# EAGLE design Wireless Weather Station (EAGLE 6.4)
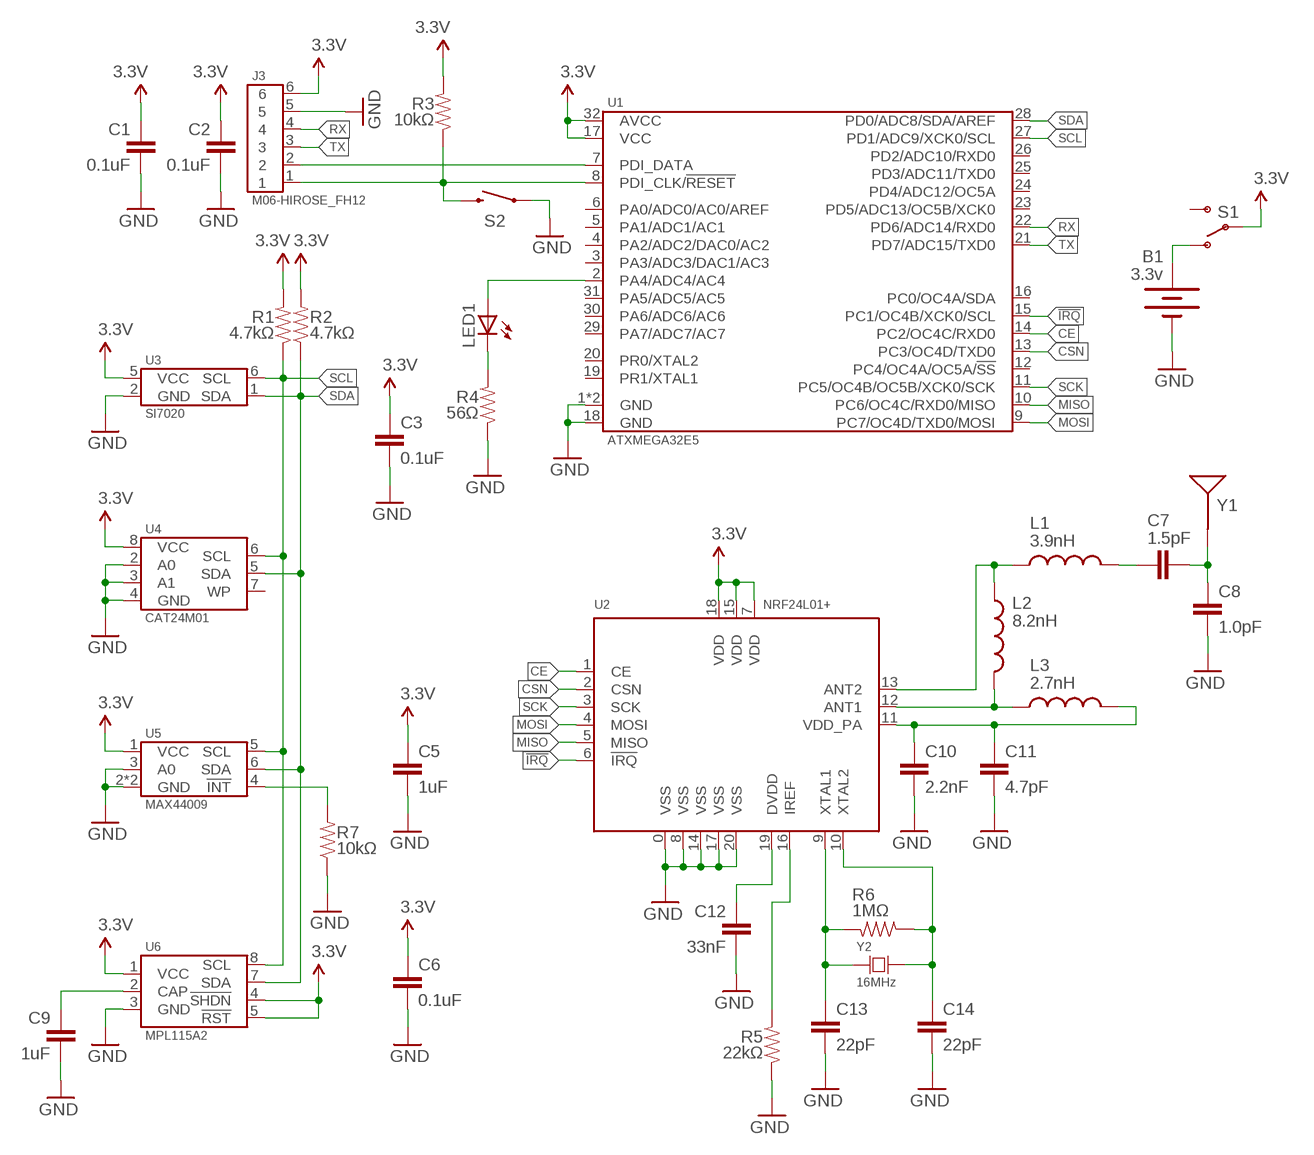
[diagram p0: schematic, sheet 1]

## Parts
B1  3.3v  BATTERY20MM-SEWABLE  [BATTCON_20MM_SEWABLE]
C1  0.1uF  CAP0402-CAP  [0402-CAP]
C2  0.1uF  CAP0402-CAP  [0402-CAP]
C3  0.1uF  CAP0402-CAP  [0402-CAP]
C5  1uF  CAP0402-CAP  [0402-CAP]
C6  0.1uF  CAP0402-CAP  [0402-CAP]
C7  1.5pF  CAP0402-CAP  [0402-CAP]
C8  1.0pF  CAP0402-CAP  [0402-CAP]
C9  1uF  CAP0402-CAP  [0402-CAP]
C10  2.2nF  CAP0402-CAP  [0402-CAP]
C11  4.7pF  CAP0402-CAP  [0402-CAP]
C12  33nF  CAP0402-CAP  [0402-CAP]
C13  22pF  CAP0402-CAP  [0402-CAP]
C14  22pF  CAP0402-CAP  [0402-CAP]
J3  M06-HIROSE_FH12  [FH12-6S-1SH(55)]
L1  3.9nH  INDUCTOR0402  [C0402]
L2  8.2nH  INDUCTOR0402  [C0402]
L3  2.7nH  INDUCTOR0402  [C0402]
LED1  LED0603  [LED-0603]
R1  4.7kΩ  RESISTOR0402-RES  [0402-RES]
R2  4.7kΩ  RESISTOR0402-RES  [0402-RES]
R3  10kΩ  RESISTOR0402-RES  [0402-RES]
R4  56Ω  RESISTOR0402-RES  [0402-RES]
R5  22kΩ  RESISTOR0402-RES  [0402-RES]
R6  1MΩ  RESISTOR0402-RES  [0402-RES]
R7  10kΩ  RESISTOR0402-RES  [0402-RES]
S1  SWITCH-SPDT-SMD-A  [SWITCH-SPST-SMD-A]
S2  SWITCH-MOMENTARY-2-SMD-1101NE  [TACTILE-SWITCH-1101NE]
U1  ATXMEGA32E5  [QFN-32]
U2  NRF24L01+  [QFN-20]
U3  SI7020  [SI7020]
U4  CAT24M01  [SO-8]
U5  MAX44009  [MAX44009]
U6  MPL115A2  [MPL115A1]
Y1  ANTENNA2SMD5  [ANTENNA-CHIP5]
Y2  16MHz  CRYSTAL-3.2X2.5  [FA-238]

## Nets
3.3V: C1.1 C2.1 C3.1 C5.1 C6.1 J3.6 R1.2 R2.2 R3.2 S1.2(P) U1.17(VCC) U1.32(AVCC) U2.7(VDD) U2.15(VDD) U2.18(VDD) U3.5(VCC) U4.8(VCC) U5.1(VCC) U6.1(VCC) U6.4(!SHDN) U6.5(!RST)
!IRQ: U1.15(PC1/OC4B/XCK0/SCL) U2.6(!IRQ)
CE: U1.14(PC2/OC4C/RXD0) U2.1(CE)
CSN: U1.13(PC3/OC4D/TXD0) U2.2(CSN)
GND: B1.2(-) C1.2 C2.2 C3.2 C5.2 C6.2 C8.2 C9.2 C10.2 C11.2 C12.2 C13.2 C14.2 J3.5 R4.1 R5.1 R7.1 S2.P$1 U1.1(GND) U1.18(GND) U1.EP(GND) U2.0(VSS) U2.8(VSS) U2.14(VSS) U2.17(VSS) U2.20(VSS) U3.2(GND) U4.2(A0) U4.3(A1) U4.4(GND) U5.2(GND) U5.3(A0) U5.PAD(GND) U6.3(GND)
MISO: U1.10(PC6/OC4C/RXD0/MISO) U2.5(MISO)
MOSI: U1.9(PC7/OC4D/TXD0/MOSI) U2.4(MOSI)
N$1: C7.1 L1.2
N$2: C9.1 U6.2(CAP)
N$3: B1.1(+) S1.1(O)
N$4: J3.1 R3.1 S2.P$2 U1.8(PDI_CLK/!RESET)
N$5: LED1.C R4.2
N$6: J3.2 U1.7(PDI_DATA)
N$7: LED1.A U1.2(PA4/ADC4/AC4)
N$8: C7.2 C8.1 Y1.FEED(SIGNAL)
N$9: R5.2 U2.16(IREF)
N$10: L1.1 L2.1 U2.13(ANT2)
N$11: C10.1 C11.1 L3.2 U2.11(VDD_PA)
N$12: L2.2 L3.1 U2.12(ANT1)
N$13: C12.1 U2.19(DVDD)
N$14: C13.1 R6.2 U2.9(XTAL1) Y2.1
N$15: C14.1 R6.1 U2.10(XTAL2) Y2.3
N$16: R7.2 U5.4(!INT)
RX: J3.4 U1.22(PD6/ADC14/RXD0)
SCK: U1.11(PC5/OC4B/OC5B/XCK0/SCK) U2.3(SCK)
SCL: R1.1 U1.27(PD1/ADC9/XCK0/SCL) U3.6(SCL) U4.6(SCL) U5.5(SCL) U6.8(SCL)
SDA: R2.1 U1.28(PD0/ADC8/SDA/AREF) U3.1(SDA) U4.5(SDA) U5.6(SDA) U6.7(SDA)
TX: J3.3 U1.21(PD7/ADC15/TXD0)
Unconnected: S1.3(S) U1.3(PA3/ADC3/DAC1/AC3) U1.4(PA2/ADC2/DAC0/AC2) U1.5(PA1/ADC1/AC1) U1.6(PA0/ADC0/AC0/AREF) U1.12(PC4/OC4A/OC5A/!SS!) U1.16(PC0/OC4A/SDA) U1.19(PR1/XTAL1) U1.20(PR0/XTAL2) U1.23(PD5/ADC13/OC5B/XCK0) U1.24(PD4/ADC12/OC5A) U1.25(PD3/ADC11/TXD0) U1.26(PD2/ADC10/RXD0) U1.29(PA7/ADC7/AC7) U1.30(PA6/ADC6/AC6) U1.31(PA5/ADC5/AC5) U4.7(WP)

## Library data of the parts
B1 = SparkFun-Electromechanical:BATTERY: Battery Holders Various common sizes : AA, AAA, 20mm coin cell and 12mm coin cell. 20MM_4LEGS, BATT-10373; PROD_ID: DEV-08822
C1-C3 C5-C14 = SparkFun-Passives:CAP: Capacitor Standard 0603 ceramic capacitor, and 0.1" leaded capacitor.
J3 = Hirose:M06
L1-L3 = SparkFun-Passives:INDUCTOR: Inductors Basic Inductor/Choke - 0603 and 1206. Footprints are not proven and vary greatly between part numbers. SRN6045- 33uH, 20% 1.4A SDR0403-560KL - 56uH, 10%, 500mA RMS/740mA peak
LED1 = SparkFun-LED:LED: LEDs Standard schematic elements and footprints for 5mm, 3mm, 1206, and 0603 sized LEDs. 5mm - Spark Fun Electronics SKU : COM-00529 (and others)
R1-R7 = SparkFun-Passives:RESISTOR: Resistor Basic schematic elements and footprints for 0603, 1206, and PTH resistors.
S1 = SparkFun-Electromechanical:SWITCH-SPDT: SPDT Switch Simple slide switch, Spark Fun Electronics SKU : COM-00102 DPDT SMT slide switch, AYZ0202, SWCH-08179
S2 = SparkFun-Electromechanical:SWITCH-MOMENTARY-2: Various NO switches- pushbuttons, reed, etc
U1 = Atmel:ATXMEGA32E5
U2 = Nordic:NRF24L01+
U3 = Silicon Labs:SI7020: Silicon Labs Humidity/Temperature Sensor
U4 = ON Semiconductor:CAT24M01: 1Mb I2C CMOS EEPROM
U5 = Maxim:MAX44009: Ambient Light Sensor
U6 = Freescale:MPL115A2: Barometric Pressure Sensor
Y1 = SparkFun-RF:ANTENNA2: Chip antenna Single endded antenna. Common with smaller chip antennas. CHIP4 package is the GPS Chip Antenna SKU: GPS-08418. CHIP5 package is 2.4GHz chip antenna SKU: WRL-00144.
Y2 = Passives:CRYSTAL

## Board
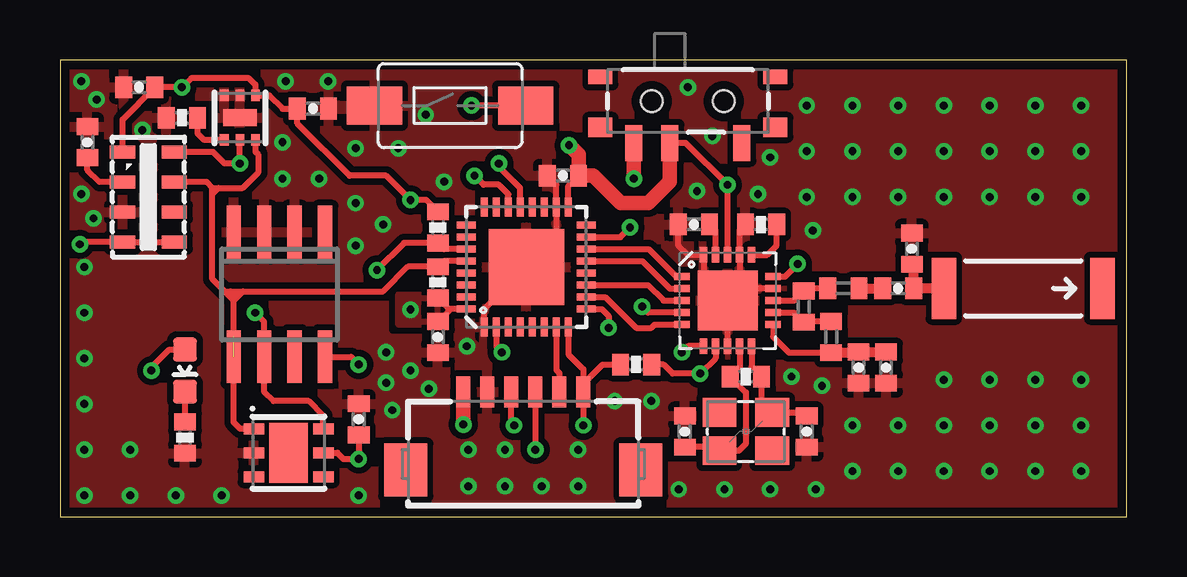
[diagram p1: board, top side]
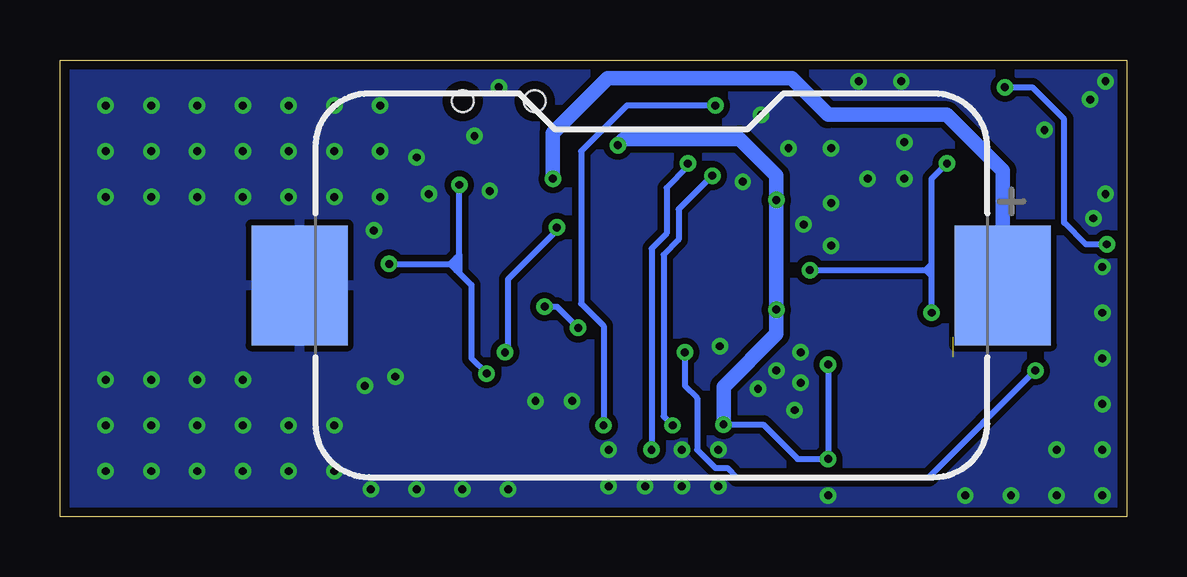
[diagram p2: board, bottom side, seen from below]

Size 44.45 x 19.05 mm. Coordinates in mm from the lower left corner, seen from the top.
Outline: 0,0 44.45,0 44.45,19.05 0,19.05 0,0
Copper layers (1*16): Top 0.0356mm / dielectric 1.5011mm / Bottom 0.0356mm
Design rules "oshpark-2layer": minimum track width 6mil, minimum drill 13mil, track to track 6mil, track to pad 6mil, pad to pad 6mil, via to via 6mil, smd to smd 6mil, copper to edge 15mil, drill to drill 6mil, minimum pad ring 7mil, minimum via ring 7mil, stop-mask expansion 4mil, vias tented up to drill 0mil, thermal gap 10mil

### Footprints (pad centres in the part's own frame; a part is rotated, then mirrored left to right if it is on the bottom)
BATTCON_20MM_SEWABLE = smd 4 x 5: 1 14.65,0; 2 -14.65,0
0402-CAP = smd 0.7 x 0.9: 1 -0.65,0; 2 0.65,0
FH12-6S-1SH(55) = smd 0.6 x 1.3: 1 -2.5,0; 2 -1.5,0; 3 -0.5,0; 4 0.5,0; 5 1.5,0; 6 2.5,0 | smd 1.8 x 2.2: P$7 -4.9,3.25; P$8 4.9,3.25
C0402 = smd 0.7 x 0.9: 1 -0.65,0; 2 0.65,0
LED-0603 = smd 1 x 1: A 0,-0.877; C 0,0.877
0402-RES = smd 0.7 x 0.9: 1 -0.65,0; 2 0.65,0
SWITCH-SPST-SMD-A = smd 0.7 x 1.5: 1 -2.25,-1.75; 2 -0.75,-1.75; 3 2.25,-1.75 | smd 1 x 0.6: GND1 -3.65,1; GND3 3.65,1 | smd 1 x 0.8: GND2 -3.65,-1.1; GND4 3.65,-1.1 | hole 0.9: -1.5,0; 1.5,0
TACTILE-SWITCH-1101NE = smd 2.3 x 1.6: P$1 -3.15,0; P$2 3.15,0
QFN-32 = smd 0.285 x 0.8: 1 -1.75,-2.5; 2 -1.25,-2.5; 3 -0.75,-2.5; 4 -0.25,-2.5; 5 0.25,-2.5; 6 0.75,-2.5; 7 1.25,-2.5; 8 1.75,-2.5; 17 1.75,2.5; 18 1.25,2.5; 19 0.75,2.5; 20 0.25,2.5; 21 -0.25,2.5; 22 -0.75,2.5; 23 -1.25,2.5; 24 -1.75,2.5 | smd 0.8 x 0.285: 9 2.5,-1.75; 10 2.5,-1.25; 11 2.5,-0.75; 12 2.5,-0.25; 13 2.5,0.25; 14 2.5,0.75; 15 2.5,1.25; 16 2.5,1.75; 25 -2.5,1.75; 26 -2.5,1.25; 27 -2.5,0.75; 28 -2.5,0.25; 29 -2.5,-0.25; 30 -2.5,-0.75; 31 -2.5,-1.25; 32 -2.5,-1.75 | smd 3.15 x 3.15: EP 0,0
QFN-20 = smd 2.5 x 2.5: 0 0,0 | smd 0.65 x 0.3: 1 -1.9,1; 2 -1.9,0.5; 3 -1.9,0; 4 -1.9,-0.5; 5 -1.9,-1; 11 1.9,-1; 12 1.9,-0.5; 13 1.9,0; 14 1.9,0.5; 15 1.9,1 | smd 0.3 x 0.65: 6 -1,-1.9; 7 -0.5,-1.9; 8 0,-1.9; 9 0.5,-1.9; 10 1,-1.9; 16 1,1.9; 17 0.5,1.9; 18 0,1.9; 19 -0.5,1.9; 20 -1,1.9
SI7020 = smd 0.85 x 0.45: 1 -1.45,1; 2 -1.45,0; 3 -1.45,-1; 4 1.45,-1; 5 1.45,0; 6 1.45,1 | smd 1.6 x 2.5: PAD 0,0
SO-8 = smd 2.2 x 0.6: 1 -2.6,1.905; 2 -2.6,0.635; 3 -2.6,-0.635; 4 -2.6,-1.905; 5 2.6,-1.905; 6 2.6,-0.635; 7 2.6,0.635; 8 2.6,1.905
MAX44009 = smd 0.48 x 0.36: 1 -0.925,0.65; 2 -0.925,0; 3 -0.925,-0.65; 4 0.925,-0.65; 5 0.925,0; 6 0.925,0.65 | smd 0.71 x 1.4: PAD 0,0
MPL115A1 = smd 1.05 x 0.55: 1 -1.075,1.875; 2 -1.075,0.625; 3 -1.075,-0.625; 4 -1.075,-1.875; 5 1.075,-1.875; 6 1.075,-0.625; 7 1.075,0.625; 8 1.075,1.875
ANTENNA-CHIP5 = smd 1.016 x 2.54: FEED -3.302,0; NC 3.302,0
FA-238 = smd 1.4 x 1.2: 1 -1.1,-0.8; 2 1.1,-0.8; 3 1.1,0.8; 4 -1.1,0.8

### Placement (x,y rotation side)
B1  19.81,9.65 0 bottom
C1  20.95,14.22 180 top
C2  15.75,7.49 270 top
C3  12.45,4.06 90 top
C5  10.54,17.02 0 top
C6  3.3,17.91 180 top
C7  34.92,9.53 0 top
C8  35.5,11.18 90 top
C9  1.14,15.62 90 top
C10  33.27,6.22 270 top
C11  34.42,6.22 270 top
C12  26.42,12.19 180 top
C13  26.04,3.56 90 top
C14  31.11,3.56 270 top
J3  19.3,5.21 180 top
L1  32.64,9.53 0 top
L2  30.99,8.76 270 top
L3  32.13,7.49 270 top
LED1  5.21,6.1 180 top
R1  15.75,12.06 90 top
R2  15.75,9.78 270 top
R3  24,6.35 0 top
R4  5.21,3.3 90 top
R5  29.21,12.19 0 top
R6  28.57,5.84 180 top
R7  5.08,16.64 0 top
S1  26.16,17.34 0 top
S2  16.26,17.14 0 top
U1  19.43,10.41 0 top
U2  27.81,9.02 0 top
U3  9.53,2.67 0 top
U4  9.14,9.27 270 top
U5  7.49,16.64 270 top
U6  3.68,13.34 0 top
Y1  40.13,9.53 0 top
Y2  28.57,3.56 0 top

### Tracks (layer width: path | path; a pad name or v marks a point on that pad's centre or on a via)
3.3V  (via drill 0.33)
  Top 0.254: U1.17 21.18,13.8 C1.1 | U1.32 16.21,8.66 | 16.21,8.66 R2.2 | 16.21,8.66 16.21,8.61 C2.1 | U2.18 v27.81,13.84 26.07,15.59 S1.2 | U2.7 27.31,6.61 v26.67,5.97 25.53,5.97 25.15,6.35 R3.2 | U2.15 30.21,10.02 v30.73,10.54 | C3.1 v12.45,2.41 11.81,2.41 11.56,2.67 U3.5 | U4.8 12.12,6.67 v12.45,6.35 | R1.2 15.26,13.21 v14.61,13.21 13.59,14.22 12.06,14.22 9.89,16.4 C5.1 9.27,17.02 8.73,17.56 U5.1 8.14,18.02 7.87,18.29 5.46,18.29 v5.08,17.91 C6.1 | U6.5 U6.4 0.93,11.46 v0.83,11.36 | C6.1 | U6.1 2.61,16.56 C6.1
  Top 0.61: S1.2 25.41,13.98 24.51,13.08 23.37,13.08 22.23,14.22 C1.1 21.61,15.1 v21.21,15.49 | J3.6 v16.8,3.85
  Bottom 0.254: v30.73,10.54 28.19,10.54 | 28.19,10.54 27.93,10.79 | U2.18 v27.81,13.84 | 28.19,10.54 27.31,9.66 27.31,6.61 v26.67,5.97 | U2.18 27.81,10.16 | 27.94,10.29 27.94,10.79 27.93,10.79 | 27.93,10.79 U2.18 | v16.8,3.85 15.15,3.85 13.72,2.41 v12.45,2.41 v12.45,6.35 | v5.08,17.91 3.94,17.91 2.61,16.58 2.61,12.26 1.71,11.36 v0.83,11.36
  Bottom 0.61: v16.8,3.85 16.8,5.42 14.61,7.62 v14.61,8.64 v14.61,13.21 14.61,14.22 16.13,15.75 20.95,15.75 v21.21,15.49
  pour Top: 16,9.27 16,8 14.1,8 14.1,9.27
!IRQ  (via drill 0.33)
  Top 0.254: U2.6 26.17,7.12 v25.91,6.86 | U1.15 23.35,11.66 v23.75,12.06
  Bottom 0.254: v25.91,6.86 25.78,6.99 25.78,9.91 23.75,11.94 v23.75,12.06
CE
  Top 0.254: U1.14 24.52,11.16 25.67,10.02 U2.1
CSN
  Top 0.254: U1.13 24.26,10.66 25.41,9.52 U2.2
GND  (via drill 0.33)
  Top 0.254: R5.1 28.31,11.95 U2.17 28.31,9.9 28.07,9.65 28.07,9.27 U2.0 | C12.2 25.77,11.32 26.17,10.92 U2.20 26.81,10.02 U2.0 | U2.8 U2.0 | C1.2 20.68,13.85 U1.18 20.68,11.79 20.32,11.43 20.32,11.3 U1.EP 17.68,8.66 U1.1 | U2.14 28.31,9.52 U2.0
  other vias: 42.55,17.14 42.55,15.24 42.55,13.34 40.64,13.34 40.64,15.24 40.64,17.14 38.73,17.14 38.73,15.24 38.73,13.34 36.83,13.34 36.83,15.24 36.83,17.14 34.92,17.14 34.92,13.34 34.92,15.24 31.37,11.94 33.02,13.34 31.11,13.34 31.11,15.24 31.11,17.14 33.02,17.14 33.02,15.24 42.55,5.71 42.55,3.81 42.55,1.91 40.64,1.91 40.64,3.81 40.64,5.71 38.73,5.71 38.73,3.81 38.73,1.91 36.83,5.71 36.83,3.81 34.92,3.81 33.02,3.81 33.02,1.91 34.92,1.91 36.83,1.91 29.08,13.46 26.54,13.59 24.64,4.83 31.5,1.14 29.59,1.14 27.69,1.14 25.78,1.14 23.11,4.83 21.59,2.79 21.59,1.27 20.07,1.27 18.54,1.27 18.54,2.79 15.37,5.33 17.02,1.27 17.02,2.79 16.95,7.11 13.59,5.59 13.84,4.45 14.1,15.37 26.16,17.91 27.18,15.88 9.27,15.62 10.79,14.1 9.27,14.1 12.32,13.08 12.32,15.37 12.45,0.89 0.89,18.16 1.52,17.4 3.43,16.13 0.89,13.46 11.18,18.16 1.4,12.45 13.46,12.19 12.32,11.3 29.59,14.99 16,13.97 15.24,16.76 9.4,18.16 13.59,6.86 14.61,6.1 31.75,5.46 30.48,5.84 6.73,0.89 4.83,0.89 2.92,0.89 1.02,0.89 1.02,2.79 1.02,4.7 1.02,6.6 1.02,8.51 1.02,10.41 2.92,2.79
  pour Bottom (isolate 0.254, rank 2): -2.54,21.59 46.99,21.59 46.99,-2.54 -2.54,-2.54
  pour Top (isolate 0.254, rank 2): -1.27,20.32 45.72,20.32 45.72,-1.27 -1.27,-1.27
MISO
  Top 0.254: U1.10 22.71,9.16 24,7.87 24.64,7.87 24.78,8.02 U2.5
MOSI  (via drill 0.33)
  Top 0.254: U2.4 24.5,8.52 v24.26,8.76 | U1.9 22.58,8.66 22.86,8.38 v22.86,7.87
  Bottom 0.254: v24.26,8.76 23.75,8.76 v22.86,7.87
N$1
  Top 0.254: 33.4,9.53 L1.2 | 34.16,9.53 C7.1
  Top 0.406: 33.4,9.53 34.16,9.53
N$2
  Top 0.254: U6.2 1.65,13.96 1.14,14.46 C9.1
N$3  (via drill 0.33)
  Top 0.61: v23.91,14.1 S1.1
  Bottom 0.61: v23.91,14.1 23.91,16 21.63,18.29 13.97,18.29 12.45,16.76 7.49,16.76 5.16,14.43 B1.1
N$4  (via drill 0.33)
  Top 0.254: J3.1 21.8,6.15 21.18,6.77 U1.8 | J3.1 21.97,5.71 22.61,6.35 R3.1 | S2.P$2 v17.14,17.14 | J3.1 v21.8,3.81
  Bottom 0.254: v17.14,17.14 20.83,17.14 22.73,15.24 22.73,8.89 21.8,7.96 v21.8,3.81
N$5
  Top 0.254: LED1.C R4.2
N$6
  Top 0.254: U1.7 20.68,6.12 20.8,5.99 J3.2
N$7  (via drill 0.33)
  Top 0.254: U1.2 18.18,7.09 v18.41,6.86 | v3.81,6.1 3.81,6.22 4.56,6.97 LED1.A
  Bottom 0.254: v18.41,6.86 18.41,5.46 17.91,4.95 17.91,2.79 17.14,2.03 16.64,2.03 16.26,1.65 8.26,1.65 v3.81,6.1
N$8
  Top 0.254: C7.2 35.69,9.53
  Top 0.406: Y1.FEED 35.69,9.53 | C7.2 35.58,10.45
  Top 0.686: 35.58,10.45 C8.1
N$9
  Top 0.254: U2.16 29.46,10.92 29.86,11.32 R5.2
N$10
  Top 0.254: L1.1 31.1,9.53 L2.1 30.59,9.02 U2.13
N$11
  Top 0.254: U2.11 29.71,7.5 30.37,6.84 L3.2
  Top 0.406: L3.2 33.24,6.84 C10.1 C11.1
N$12
  Top 0.254: L3.1 31.02,8.14 L2.2 30.58,8.52 U2.12
N$13
  Top 0.254: U2.19 27.31,11.95 C12.1
N$14
  Top 0.254: U2.9 28.31,6.23 R6.2 28.57,5.19 28.57,3.05 28.28,2.76 Y2.1 27.32,2.91 C13.1
N$15
  Top 0.254: U2.10 28.81,6.25 R6.1 29.23,4.81 Y2.3 30.96,4.36 C14.1
N$16
  Top 0.254: U5.4 6,15.71 5.73,15.99 R7.2
RX  (via drill 0.33)
  Top 0.254: U1.22 18.68,13.45 18.29,13.84 17.65,13.84 v17.27,14.22 | v18.92,3.81 18.8,3.94 J3.4
  Bottom 0.254: v17.27,14.22 18.67,12.83 18.67,11.56 19.3,10.92 19.3,4.19 v18.92,3.81
SCK
  Top 0.254: U1.11 24.5,9.66 25.15,9.02 U2.3
SCL  (via drill 0.33)
  Top 0.254: U1.27 16,11.16 R1.1 14.34,11.41 v13.21,10.29 | U3.6 10.97,4.21 10.36,4.83 8.9,4.83 8.51,5.22 U4.6 8.51,8.13 v8.13,8.51 | U5.5 v7.49,14.73 6.86,14.73 6.38,15.21 U6.8
  Bottom 0.254: v13.21,10.29 8.38,10.29 | 8.38,10.29 8.13,10.29 | v7.49,14.73 8.13,14.1 8.13,10.54 | v8.13,8.51 8.13,10.03 | 8.13,10.03 8.13,10.29 | 8.13,10.29 8.13,10.54 | 8.13,10.54 8.38,10.29 | 8.38,10.29 8.13,10.03
SDA  (1 unrouted)
  Top 0.254: U1.28 15.98,10.66 R2.1 14.49,10.43 13.46,9.4 7.62,9.4 | U3.1 7.51,3.67 7.24,3.94 U4.5 | 6.86,9.4 6.35,9.91 6.35,13.46 | 6.35,13.46 6.35,13.72 | 6.35,13.72 6.6,13.72 | 6.6,13.72 7.62,13.72 8.26,14.35 8.26,15.11 8.14,15.22 U5.6 | 6.6,13.72 6.35,13.46 | 6.35,13.72 6.11,13.96 U6.7 | 7.24,7.49 7.24,9.02 | 7.24,9.02 7.62,9.4 | 7.11,9.4 7.62,9.4 | 7.24,9.02 6.86,9.4 | 6.86,9.4 7.11,9.4 | 7.11,9.4 7.24,9.27
TX  (via drill 0.33)
  Top 0.254: J3.3 v19.8,2.79 | U1.21 19.18,13.72 18.29,14.61 v18.29,14.73
  Bottom 0.254: v18.29,14.73 18.29,14.61 19.18,13.72 19.18,11.81 19.8,11.18 v19.8,2.79